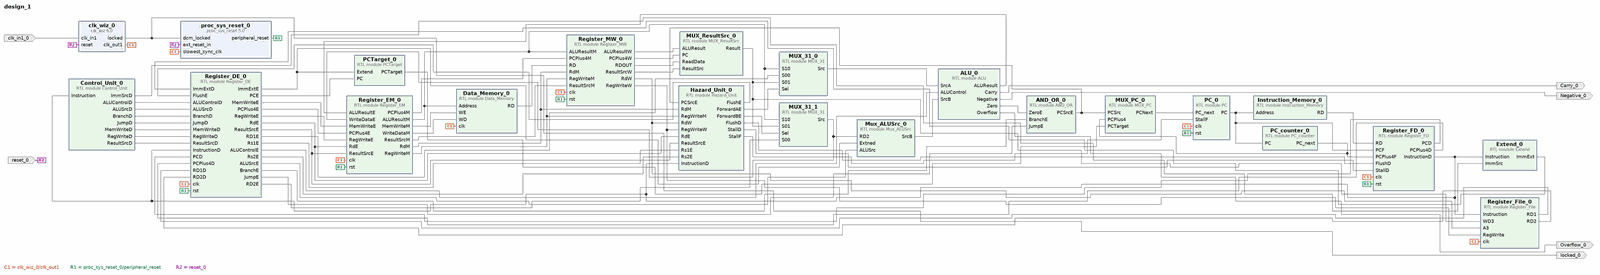
[diagram p0: block diagram of the top level, whole]
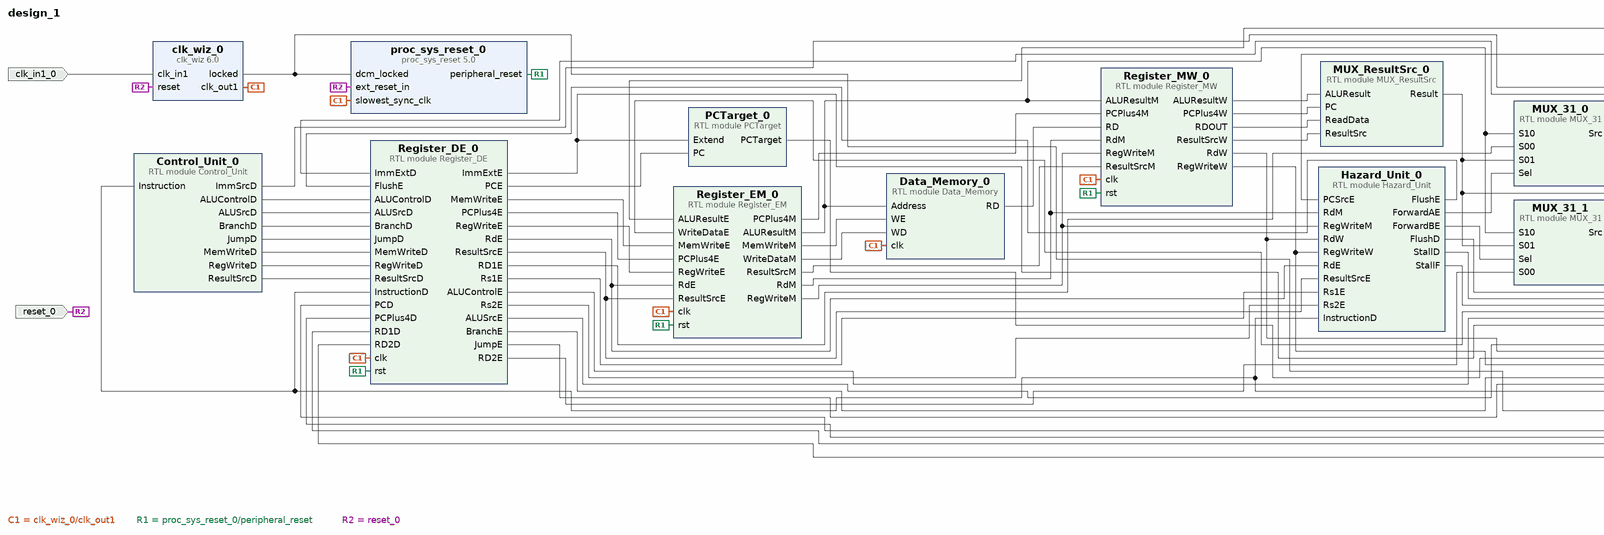
[diagram p1: block diagram of the top level, left part]
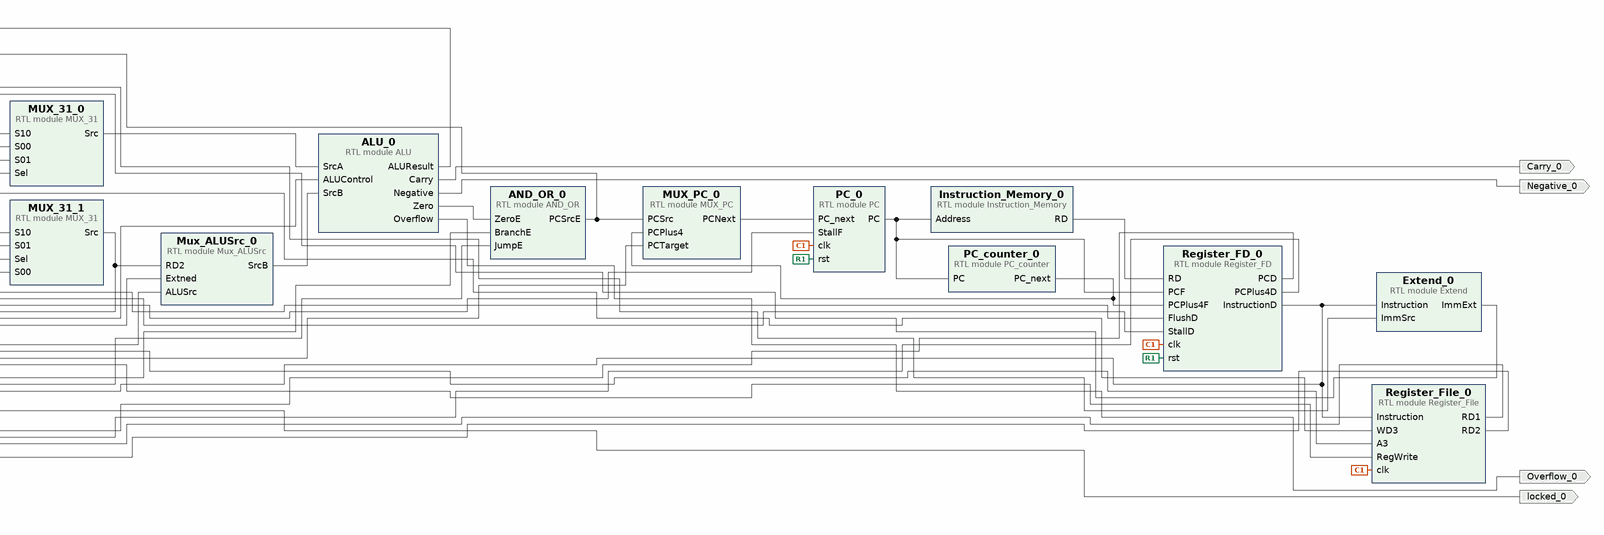
[diagram p2: block diagram of the top level, right part]
# Vivado block design design_1, xc7a12ticsg325-1L, Vivado 2025.2
create_bd_design design_1

create_bd_port -dir O Carry_0
create_bd_port -dir O Overflow_0
create_bd_port -dir O Negative_0
create_bd_port -dir I -type clk clk_in1_0
create_bd_port -dir I -type rst reset_0
set_property -dict {CONFIG.POLARITY ACTIVE_HIGH} [get_bd_ports reset_0]
create_bd_port -dir O locked_0

create_bd_cell -type module -reference MUX_PC MUX_PC_0
create_bd_cell -type module -reference PC PC_0
create_bd_cell -type module -reference Instruction_Memory Instruction_Memory_0
create_bd_cell -type module -reference PC_counter PC_counter_0
create_bd_cell -type module -reference Register_FD Register_FD_0
create_bd_cell -type module -reference Register_File Register_File_0
create_bd_cell -type module -reference Extend Extend_0
create_bd_cell -type module -reference Control_Unit Control_Unit_0
create_bd_cell -type module -reference Register_DE Register_DE_0
create_bd_cell -type module -reference MUX_31 MUX_31_0
create_bd_cell -type module -reference MUX_31 MUX_31_1
create_bd_cell -type module -reference Mux_ALUSrc Mux_ALUSrc_0
create_bd_cell -type module -reference ALU ALU_0
create_bd_cell -type module -reference Register_EM Register_EM_0
create_bd_cell -type module -reference Data_Memory Data_Memory_0
create_bd_cell -type module -reference Register_MW Register_MW_0
create_bd_cell -type module -reference MUX_ResultSrc MUX_ResultSrc_0
create_bd_cell -type module -reference AND_OR AND_OR_0
create_bd_cell -type module -reference PCTarget PCTarget_0
create_bd_cell -type module -reference Hazard_Unit Hazard_Unit_0
create_bd_cell -type ip -vlnv xilinx.com:ip:clk_wiz:6.0 clk_wiz_0
create_bd_cell -type ip -vlnv xilinx.com:ip:proc_sys_reset:5.0 proc_sys_reset_0

# ---- connections ----

connect_bd_net [get_bd_pins ALU_0/ALUResult] [get_bd_pins Register_EM_0/ALUResultE]
connect_bd_net [get_bd_pins ALU_0/Carry] [get_bd_ports Carry_0]
connect_bd_net [get_bd_pins ALU_0/Negative] [get_bd_ports Negative_0]
connect_bd_net [get_bd_pins ALU_0/Overflow] [get_bd_ports Overflow_0]
connect_bd_net [get_bd_pins ALU_0/Zero] [get_bd_pins AND_OR_0/ZeroE]
connect_bd_net [get_bd_pins AND_OR_0/PCSrcE] [get_bd_pins MUX_PC_0/PCSrc] [get_bd_pins Hazard_Unit_0/PCSrcE]
connect_bd_net [get_bd_pins Control_Unit_0/ALUControlD] [get_bd_pins Register_DE_0/ALUControlD]
connect_bd_net [get_bd_pins Control_Unit_0/ALUSrcD] [get_bd_pins Register_DE_0/ALUSrcD]
connect_bd_net [get_bd_pins Control_Unit_0/BranchD] [get_bd_pins Register_DE_0/BranchD]
connect_bd_net [get_bd_pins Control_Unit_0/ImmSrcD] [get_bd_pins Extend_0/ImmSrc]
connect_bd_net [get_bd_pins Control_Unit_0/JumpD] [get_bd_pins Register_DE_0/JumpD]
connect_bd_net [get_bd_pins Control_Unit_0/MemWriteD] [get_bd_pins Register_DE_0/MemWriteD]
connect_bd_net [get_bd_pins Control_Unit_0/RegWriteD] [get_bd_pins Register_DE_0/RegWriteD]
connect_bd_net [get_bd_pins Control_Unit_0/ResultSrcD] [get_bd_pins Register_DE_0/ResultSrcD]
connect_bd_net [get_bd_pins Data_Memory_0/RD] [get_bd_pins Register_MW_0/RD]
connect_bd_net [get_bd_pins Extend_0/ImmExt] [get_bd_pins Register_DE_0/ImmExtD]
connect_bd_net [get_bd_pins Hazard_Unit_0/FlushD] [get_bd_pins Register_FD_0/FlushD]
connect_bd_net [get_bd_pins Hazard_Unit_0/FlushE] [get_bd_pins Register_DE_0/FlushE]
connect_bd_net [get_bd_pins Hazard_Unit_0/ForwardAE] [get_bd_pins MUX_31_0/Sel]
connect_bd_net [get_bd_pins Hazard_Unit_0/ForwardBE] [get_bd_pins MUX_31_1/Sel]
connect_bd_net [get_bd_pins Hazard_Unit_0/StallD] [get_bd_pins Register_FD_0/StallD]
connect_bd_net [get_bd_pins Hazard_Unit_0/StallF] [get_bd_pins PC_0/StallF]
connect_bd_net [get_bd_pins Instruction_Memory_0/RD] [get_bd_pins Register_FD_0/RD]
connect_bd_net [get_bd_pins MUX_31_0/Src] [get_bd_pins ALU_0/SrcA]
connect_bd_net [get_bd_pins MUX_31_1/Src] [get_bd_pins Mux_ALUSrc_0/RD2] [get_bd_pins Register_EM_0/WriteDataE]
connect_bd_net [get_bd_pins MUX_PC_0/PCNext] [get_bd_pins PC_0/PC_next]
connect_bd_net [get_bd_pins MUX_ResultSrc_0/Result] [get_bd_pins MUX_31_0/S01] [get_bd_pins MUX_31_1/S01] [get_bd_pins Register_File_0/WD3]
connect_bd_net [get_bd_pins Mux_ALUSrc_0/SrcB] [get_bd_pins ALU_0/SrcB]
connect_bd_net [get_bd_pins Register_FD_0/InstructionD] \
  [get_bd_pins Extend_0/Instruction] [get_bd_pins Register_File_0/Instruction] [get_bd_pins Control_Unit_0/Instruction] \
  [get_bd_pins Register_DE_0/InstructionD] [get_bd_pins Hazard_Unit_0/InstructionD]
connect_bd_net [get_bd_pins PCTarget_0/PCTarget] [get_bd_pins MUX_PC_0/PCTarget]
connect_bd_net [get_bd_pins PC_0/PC] [get_bd_pins Register_FD_0/PCF] [get_bd_pins PC_counter_0/PC] [get_bd_pins Instruction_Memory_0/Address]
connect_bd_net [get_bd_pins PC_counter_0/PC_next] [get_bd_pins Register_FD_0/PCPlus4F] [get_bd_pins MUX_PC_0/PCPlus4]
connect_bd_net [get_bd_pins Register_DE_0/ALUControlE] [get_bd_pins ALU_0/ALUControl]
connect_bd_net [get_bd_pins Register_DE_0/ALUSrcE] [get_bd_pins Mux_ALUSrc_0/ALUSrc]
connect_bd_net [get_bd_pins Register_DE_0/BranchE] [get_bd_pins AND_OR_0/BranchE]
connect_bd_net [get_bd_pins Register_DE_0/ImmExtE] [get_bd_pins Mux_ALUSrc_0/Extned] [get_bd_pins PCTarget_0/Extend]
connect_bd_net [get_bd_pins Register_DE_0/JumpE] [get_bd_pins AND_OR_0/JumpE]
connect_bd_net [get_bd_pins Register_DE_0/MemWriteE] [get_bd_pins Register_EM_0/MemWriteE]
connect_bd_net [get_bd_pins Register_DE_0/PCE] [get_bd_pins PCTarget_0/PC]
connect_bd_net [get_bd_pins Register_DE_0/PCPlus4E] [get_bd_pins Register_EM_0/PCPlus4E]
connect_bd_net [get_bd_pins Register_DE_0/RD1E] [get_bd_pins MUX_31_0/S00]
connect_bd_net [get_bd_pins Register_DE_0/RD2E] [get_bd_pins MUX_31_1/S00]
connect_bd_net [get_bd_pins Register_DE_0/RdE] [get_bd_pins Register_EM_0/RdE] [get_bd_pins Hazard_Unit_0/RdE]
connect_bd_net [get_bd_pins Register_DE_0/RegWriteE] [get_bd_pins Register_EM_0/RegWriteE]
connect_bd_net [get_bd_pins Register_DE_0/ResultSrcE] [get_bd_pins Register_EM_0/ResultSrcE] [get_bd_pins Hazard_Unit_0/ResultSrcE]
connect_bd_net [get_bd_pins Register_DE_0/Rs1E] [get_bd_pins Hazard_Unit_0/Rs1E]
connect_bd_net [get_bd_pins Register_DE_0/Rs2E] [get_bd_pins Hazard_Unit_0/Rs2E]
connect_bd_net [get_bd_pins Register_EM_0/ALUResultM] \
  [get_bd_pins Data_Memory_0/Address] [get_bd_pins MUX_31_0/S10] [get_bd_pins MUX_31_1/S10] \
  [get_bd_pins Register_MW_0/ALUResultM]
connect_bd_net [get_bd_pins Register_EM_0/MemWriteM] [get_bd_pins Data_Memory_0/WE]
connect_bd_net [get_bd_pins Register_EM_0/PCPlus4M] [get_bd_pins Register_MW_0/PCPlus4M]
connect_bd_net [get_bd_pins Register_EM_0/RdM] [get_bd_pins Register_MW_0/RdM] [get_bd_pins Hazard_Unit_0/RdM]
connect_bd_net [get_bd_pins Register_EM_0/RegWriteM] [get_bd_pins Register_MW_0/RegWriteM] [get_bd_pins Hazard_Unit_0/RegWriteM]
connect_bd_net [get_bd_pins Register_EM_0/ResultSrcM] [get_bd_pins Register_MW_0/ResultSrcM]
connect_bd_net [get_bd_pins Register_EM_0/WriteDataM] [get_bd_pins Data_Memory_0/WD]
connect_bd_net [get_bd_pins Register_FD_0/PCD] [get_bd_pins Register_DE_0/PCD]
connect_bd_net [get_bd_pins Register_FD_0/PCPlus4D] [get_bd_pins Register_DE_0/PCPlus4D]
connect_bd_net [get_bd_pins Register_File_0/RD1] [get_bd_pins Register_DE_0/RD1D]
connect_bd_net [get_bd_pins Register_File_0/RD2] [get_bd_pins Register_DE_0/RD2D]
connect_bd_net [get_bd_pins Register_MW_0/ALUResultW] [get_bd_pins MUX_ResultSrc_0/ALUResult]
connect_bd_net [get_bd_pins Register_MW_0/PCPlus4W] [get_bd_pins MUX_ResultSrc_0/PC]
connect_bd_net [get_bd_pins Register_MW_0/RDOUT] [get_bd_pins MUX_ResultSrc_0/ReadData]
connect_bd_net [get_bd_pins Register_MW_0/RdW] [get_bd_pins Register_File_0/A3] [get_bd_pins Hazard_Unit_0/RdW]
connect_bd_net [get_bd_pins Register_MW_0/RegWriteW] [get_bd_pins Register_File_0/RegWrite] [get_bd_pins Hazard_Unit_0/RegWriteW]
connect_bd_net [get_bd_pins Register_MW_0/ResultSrcW] [get_bd_pins MUX_ResultSrc_0/ResultSrc]
connect_bd_net -net clk_in1_0_1 [get_bd_ports clk_in1_0] [get_bd_pins clk_wiz_0/clk_in1]
connect_bd_net [get_bd_pins clk_wiz_0/clk_out1] \
  [get_bd_pins proc_sys_reset_0/slowest_sync_clk] [get_bd_pins PC_0/clk] [get_bd_pins Register_FD_0/clk] \
  [get_bd_pins Register_File_0/clk] [get_bd_pins Register_EM_0/clk] [get_bd_pins Data_Memory_0/clk] \
  [get_bd_pins Register_MW_0/clk] [get_bd_pins Register_DE_0/clk]
connect_bd_net [get_bd_pins clk_wiz_0/locked] [get_bd_ports locked_0] [get_bd_pins proc_sys_reset_0/dcm_locked]
connect_bd_net [get_bd_pins proc_sys_reset_0/peripheral_reset] \
  [get_bd_pins PC_0/rst] [get_bd_pins Register_FD_0/rst] [get_bd_pins Register_EM_0/rst] [get_bd_pins Register_MW_0/rst] \
  [get_bd_pins Register_DE_0/rst]
connect_bd_net -net reset_0_1 [get_bd_ports reset_0] [get_bd_pins clk_wiz_0/reset] [get_bd_pins proc_sys_reset_0/ext_reset_in]

validate_bd_design
save_bd_design
